# EAGLE schematic Integral_Granite (EAGLE 9.6.2)
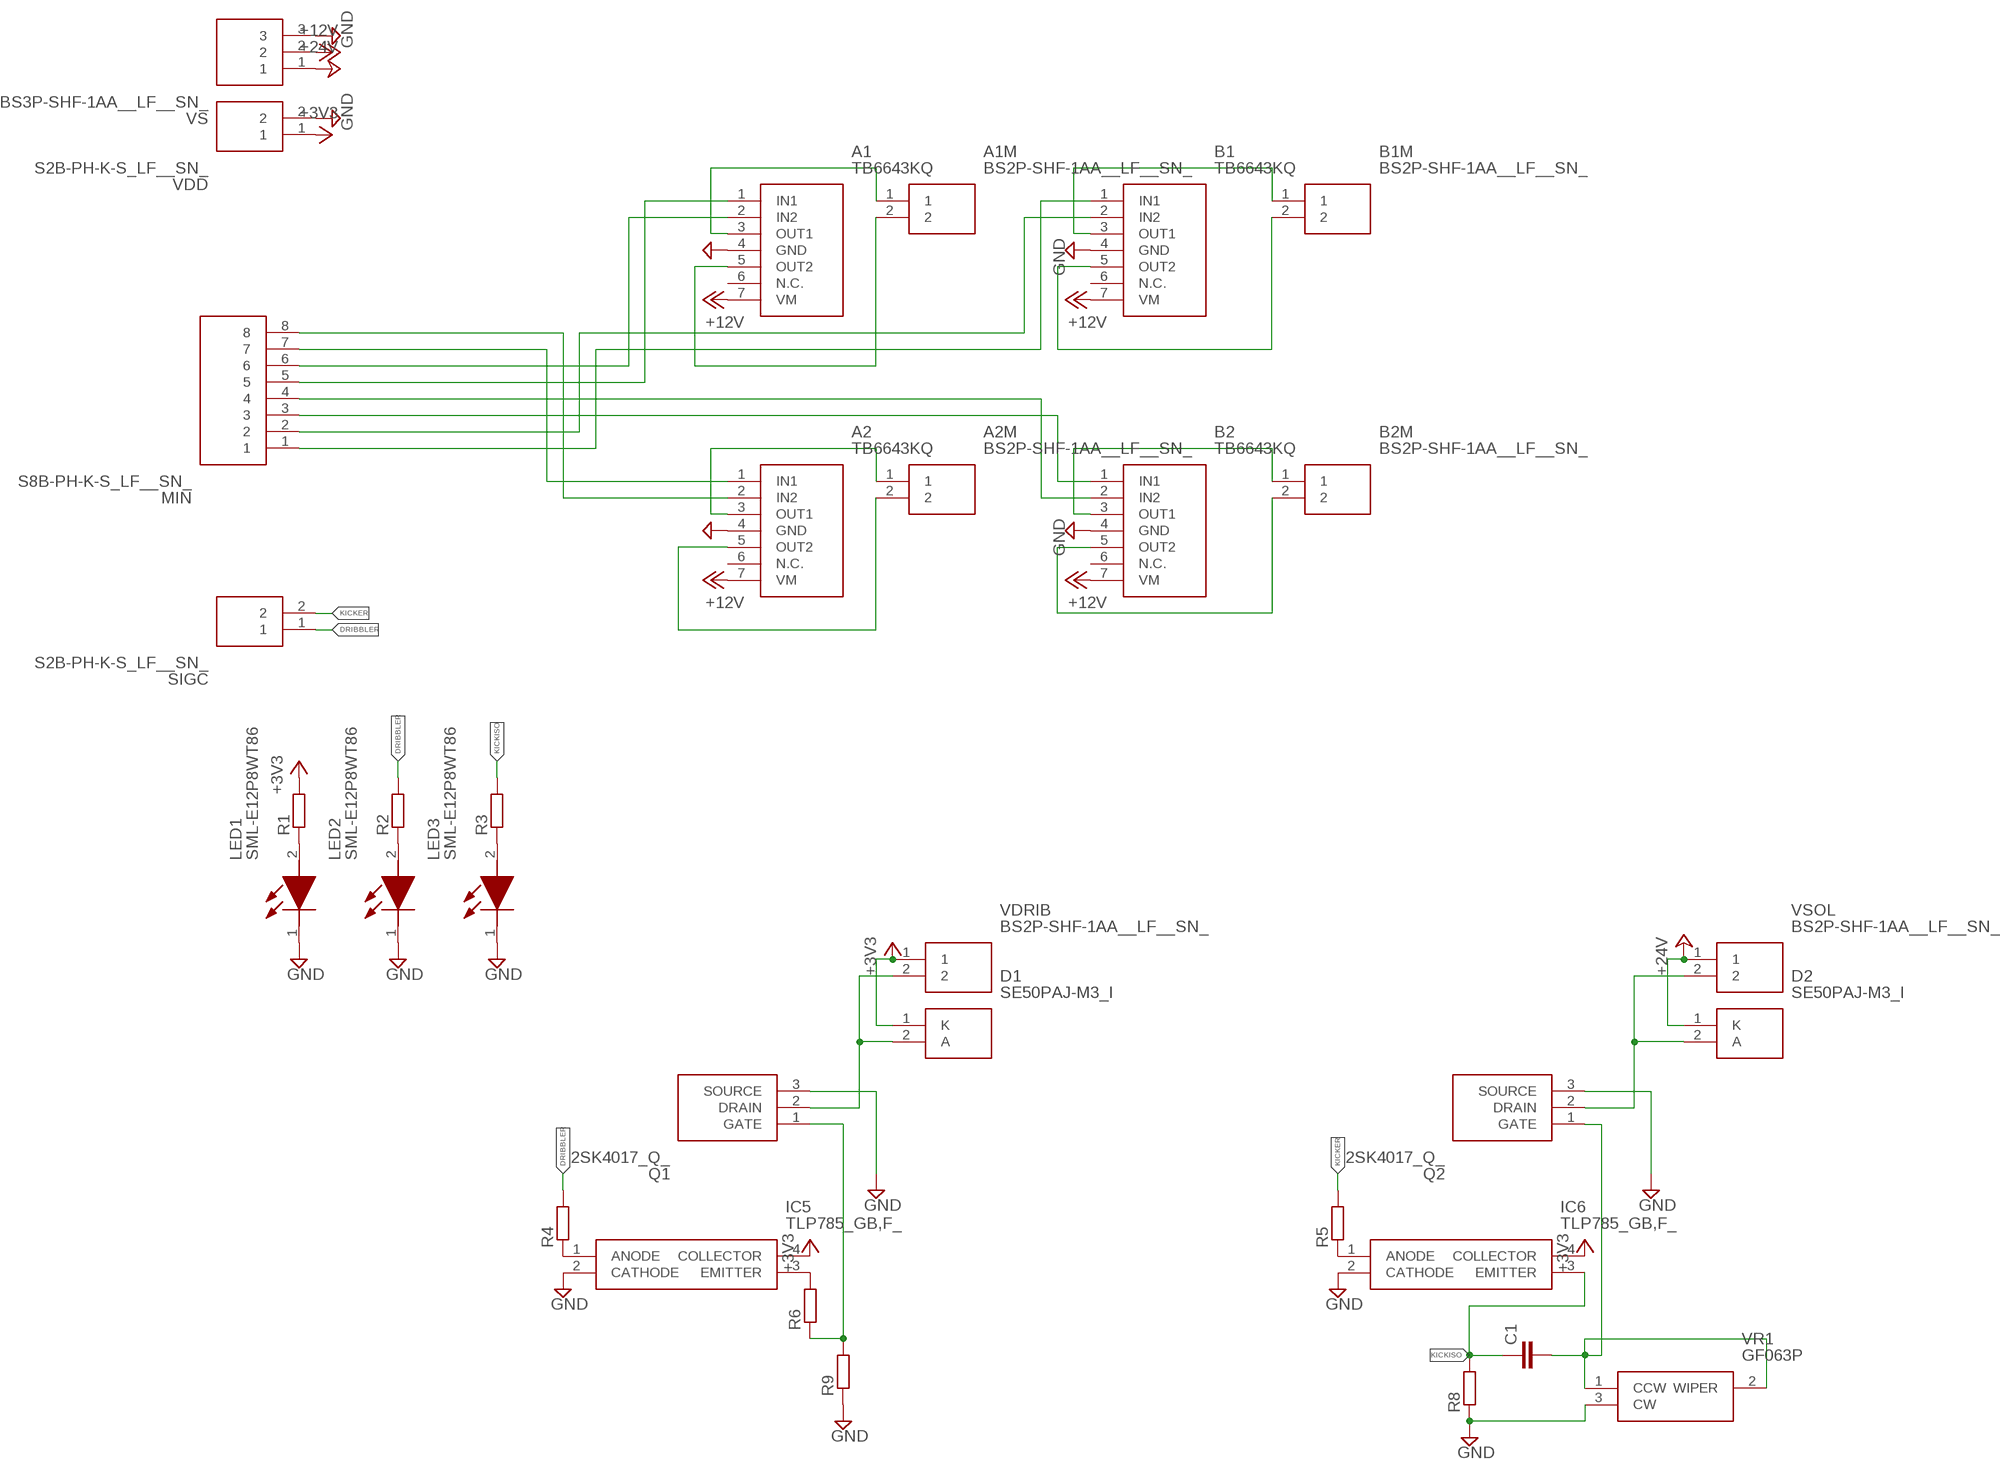
[diagram p0: schematic, sheet 1]

## Parts
A1  TB6643KQ  [TB6643KQ]
A1M  BS2P-SHF-1AA__LF__SN_  [BS2PSHF1AALFSN]
A2  TB6643KQ  [TB6643KQ]
A2M  BS2P-SHF-1AA__LF__SN_  [BS2PSHF1AALFSN]
B1  TB6643KQ  [TB6643KQ]
B1M  BS2P-SHF-1AA__LF__SN_  [BS2PSHF1AALFSN]
B2  TB6643KQ  [TB6643KQ]
B2M  BS2P-SHF-1AA__LF__SN_  [BS2PSHF1AALFSN]
C1  C-EUC0603  [C0603]
D1  SE50PAJ-M3_I  [SE50PAJM3I]
D2  SE50PAJ-M3_I  [SE50PAJM3I]
IC5  TLP785_GB,F_  [DIP762W60P254L460H425Q4N]
IC6  TLP785_GB,F_  [DIP762W60P254L460H425Q4N]
LED1  SML-E12P8WT86  [LEDC1608X36N]
LED2  SML-E12P8WT86  [LEDC1608X36N]
LED3  SML-E12P8WT86  [LEDC1608X36N]
MIN  S8B-PH-K-S_LF__SN_  [SHDRRA8W50P0X200_1X8_1790X760X]
Q1  2SK4017_Q_  [TO230P250X650X900-3P]
Q2  2SK4017_Q_  [TO230P250X650X900-3P]
R1  R-EU_R0603  [R0603]
R2  R-EU_R0603  [R0603]
R3  R-EU_R0603  [R0603]
R4  R-EU_R0603  [R0603]
R5  R-EU_R0603  [R0603]
R6  R-EU_R0603  [R0603]
R8  R-EU_R0603  [R0603]
R9  R-EU_R0603  [R0603]
SIGC  S2B-PH-K-S_LF__SN_  [SHDRRA2W50P0X200_1X2_590X760X4]
VDD  S2B-PH-K-S_LF__SN_  [SHDRRA2W50P0X200_1X2_590X760X4]
VDRIB  BS2P-SHF-1AA__LF__SN_  [BS2PSHF1AALFSN]
VR1  GF063P  [GF063P]
VS  BS3P-SHF-1AA__LF__SN_  [HDRRA3W64P0X250_1X3_750X600X56]
VSOL  BS2P-SHF-1AA__LF__SN_  [BS2PSHF1AALFSN]

## Nets
+3V3: D1.1(K) IC5.4(COLLECTOR) IC6.4(COLLECTOR) R1.2 VDD.1 VDRIB.1
+12V: A1.7(VM) A2.7(VM) B1.7(VM) B2.7(VM) VS.2
+24V: D2.1(K) VS.1 VSOL.1
DRIBBLER: R2.2 R4.2 SIGC.1
GND: A1.4(GND) A2.4(GND) B1.4(GND) B2.4(GND) IC5.2(CATHODE) IC6.2(CATHODE) LED1.1(K) LED2.1(K) LED3.1(K) Q1.3(SOURCE) Q2.3(SOURCE) R8.1 R9.1 VDD.2 VR1.3(CW) VS.3
KICKER: R5.2 SIGC.2
KICKISO: C1.1 IC6.3(EMITTER) R3.2 R8.2
KICKSIG: C1.2 Q2.1(GATE) VR1.1(CCW) VR1.2(WIPER)
N$1: A1.1(IN1) MIN.5
N$2: A1.2(IN2) MIN.6
N$3: A2.1(IN1) MIN.7
N$4: A2.2(IN2) MIN.8
N$5: B1.1(IN1) MIN.1
N$6: B1.2(IN2) MIN.2
N$7: B2.1(IN1) MIN.3
N$8: B2.2(IN2) MIN.4
N$9: A1.3(OUT1) A1M.1
N$10: A1.5(OUT2) A1M.2
N$11: A2.3(OUT1) A2M.1
N$12: A2.5(OUT2) A2M.2
N$13: B1.3(OUT1) B1M.1
N$14: B1.5(OUT2) B1M.2
N$15: B2.3(OUT1) B2M.1
N$16: B2.5(OUT2) B2M.2
N$17: LED1.2(A) R1.1
N$18: LED2.2(A) R2.1
N$19: LED3.2(A) R3.1
N$20: D1.2(A) Q1.2(DRAIN) VDRIB.2
N$22: D2.2(A) Q2.2(DRAIN) VSOL.2
N$24: Q1.1(GATE) R6.1 R9.2
N$25: IC5.1(ANODE) R4.1
N$26: IC6.1(ANODE) R5.1
N$27: IC5.3(EMITTER) R6.2
Unconnected: A1.6(N.C.) A2.6(N.C.) B1.6(N.C.) B2.6(N.C.)

## Library data of the parts
A1 A2 B1 B2 = TB6643KQ:TB6643KQ: IC MOTOR DRIVER 10V-45V 7HSIP Source: Datasheet <https://toshiba.semicon-storage.com/ap-en/semiconductor/product/motor-driver-ics/brushed-dc-motor-driver-ics/detail.TB6643KQ.html>; DESCRIPTION: IC MOTOR DRIVER 10V-45V 7HSIP; HEIGHT: 16.5mm; MANUFACTURER_NAME: Toshiba; MANUFACTURER_PART_NUMBER: TB6643KQ
A1M A2M B1M B2M VDRIB VSOL = BS2P-SHF-1AA__LF__SN_:BS2P-SHF-1AA__LF__SN_: JST NH Series, 2.5mm Pitch 2 Way 1 Row Right Angle PCB Header, Solder Termination, 3A Source: Datasheet <http://uk.rs-online.com/web/p/products/5468552>; DESCRIPTION: JST NH Series, 2.5mm Pitch 2 Way 1 Row Right Angle PCB Header, Solder Termination, 3A; HEIGHT: 5mm; MANUFACTURER_NAME: JST (JAPAN SOLDERLESS TERMINALS); MANUFACTURER_PART_NUMBER: BS2P-SHF-1AA (LF)(SN); RS_PART_NUMBER: 5468552; RS_PRICE-STOCK: http://uk.rs-online.com/web/p/products/5468552
C1 = rcl:C-EU: CAPACITOR, European symbol; SPICEPREFIX: C
D1 D2 = SE50PAJ-M3_I:SE50PAJ-M3_I: DIODE GEN PURP 600V 1.6A DO221BC Source: Datasheet <https://datasheet.datasheetarchive.com/originals/distributors/DKDS-23/457059.pdf>; DESCRIPTION: DIODE GEN PURP 600V 1.6A DO221BC; HEIGHT: 1mm; MANUFACTURER_NAME: Vishay; MANUFACTURER_PART_NUMBER: SE50PAJ-M3/I
IC5 IC6 = TLP785_GB_F_:TLP785_GB,F_: Transistor Output Optocouplers Photo-IC 60mA 80V 5000 Vrms 8000 Vpk Source: Datasheet <https://toshiba.semicon-storage.com/info/docget.jsp?did=10569&prodName=TLP785F>; DESCRIPTION: Transistor Output Optocouplers Photo-IC 60mA 80V 5000 Vrms 8000 Vpk; HEIGHT: 4.25mm; MANUFACTURER_NAME: Toshiba; MANUFACTURER_PART_NUMBER: TLP785(GB,F)
LED1-LED3 = SML-E12P8WT86:SML-E12P8WT86: Standard LEDs - SMD SMD Green 2.5-16 mcd Source: Datasheet <https://datasheet.datasheetarchive.com/originals/distributors/Datasheets_SAMA/84ce583dd15750dd00b5178de73e2c79.pdf>; DESCRIPTION: Standard LEDs - SMD SMD Green 2.5-16 mcd; HEIGHT: 0.36mm; MANUFACTURER_NAME: ROHM Semiconductor; MANUFACTURER_PART_NUMBER: SML-E12P8WT86; RS_PART_NUMBER: 7526865; RS_PRICE-STOCK: https://uk.rs-online.com/web/p/products/7526865
MIN = S8B-PH-K-S_LF__SN_:S8B-PH-K-S_LF__SN_: JST PH Series, Series Number S8B, 2mm Pitch 8 Way 1 Row Right Angle PCB Header, Through Hole Termination, 2A Source: Datasheet <http://uk.rs-online.com/web/p/products/8201517P>; DESCRIPTION: JST PH Series, Series Number S8B, 2mm Pitch 8 Way 1 Row Right Angle PCB Header, Through Hole Termination, 2A; HEIGHT: 4.8mm; MANUFACTURER_NAME: JST (JAPAN SOLDERLESS TERMINALS); MANUFACTURER_PART_NUMBER: S8B-PH-K-S(LF)(SN); RS_PART_NUMBER: 8201517P; RS_PRICE-STOCK: http://uk.rs-online.com/web/p/products/8201517P
Q1 Q2 = 2SK4017_Q_:2SK4017_Q_: MOSFET,Nch,60V/5A/0.1ohm,New Pw-Mold2 Source: Datasheet <http://uk.rs-online.com/web/p/products/0185580>; DESCRIPTION: MOSFET,Nch,60V/5A/0.1ohm,New Pw-Mold2; HEIGHT: 2.5mm; MANUFACTURER_NAME: Toshiba; MANUFACTURER_PART_NUMBER: 2SK4017(Q); RS_PART_NUMBER: 0185580; RS_PRICE-STOCK: http://uk.rs-online.com/web/p/products/0185580
R1-R6 R8 R9 = rcl:R-EU_: RESISTOR, European symbol; SPICEPREFIX: R
SIGC VDD = S2B-PH-K-S_LF__SN_:S2B-PH-K-S_LF__SN_: PH-2.0mm Header side entry 2 way JST PH Series, Series Number S2B, 2mm Pitch 2 Way 1 Row Right Angle PCB Header, Through Hole Termination, 2A Source: Datasheet <http://uk.rs-online.com/web/p/products/8201494P>; DESCRIPTION: PH-2.0mm Header side entry 2 way JST PH Series, Series Number S2B, 2mm Pitch 2 Way 1 Row Right Angle PCB Header, Through Hole Termination, 2A; HEIGHT: 4.8mm; MANUFACTURER_NAME: JST (JAPAN SOLDERLESS TERMINALS); MANUFACTURER_PART_NUMBER: S2B-PH-K-S(LF)(SN); RS_PART_NUMBER: 8201494P; RS_PRICE-STOCK: http://uk.rs-online.com/web/p/products/8201494P
VR1 = GF063P:GF063P: 1/4 Square, Single-Turn, Through-Hole Sealed Cermet Trimmers Source: Datasheet; DESCRIPTION: 1/4 Square, Single-Turn, Through-Hole Sealed Cermet Trimmers; HEIGHT: 5.8mm; MANUFACTURER_NAME: Tocos; MANUFACTURER_PART_NUMBER: GF063P
VS = BS3P-SHF-1AA__LF__SN_:BS3P-SHF-1AA__LF__SN_: JST HVQ Series, 2.5mm Pitch 3 Way 1 Row Right Angle PCB Header, Solder Termination, 3A Source: Datasheet <http://uk.rs-online.com/web/p/products/5468568>; DESCRIPTION: JST HVQ Series, 2.5mm Pitch 3 Way 1 Row Right Angle PCB Header, Solder Termination, 3A; HEIGHT: 5.6mm; MANUFACTURER_NAME: JST (JAPAN SOLDERLESS TERMINALS); MANUFACTURER_PART_NUMBER: BS3P-SHF-1AA (LF)(SN); RS_PART_NUMBER: 5468568; RS_PRICE-STOCK: http://uk.rs-online.com/web/p/products/5468568